# EAGLE design simple_led_button (EAGLE 8.7.0)
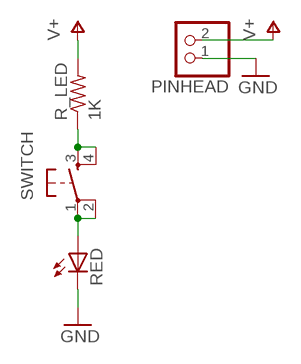
[diagram p0: schematic, sheet 1]

## Parts
PINHEAD  PINHD-1X2  [1X02]
R_LED  1K  RES-US1206FAB  [R1206FAB]
RED  LEDFAB1206  [LED1206FAB]
SWITCH  6MM_SWITCH6MM_SWITCH  [6MM_SWITCH]

## Nets
GND: PINHEAD.1 RED.2(C)
N$1: R_LED.1 SWITCH.3(S) SWITCH.4(S1)
N$2: RED.1(A) SWITCH.1(P) SWITCH.2(P1)
V+: PINHEAD.2 R_LED.2

## Library data of the parts
PINHEAD = pinhead:PINHD-1X2: PIN HEADER
R_LED = fab:RES-US: Resistor (US Symbol) Variants with postfix FAB are widened to allow the routing of internal traces
RED = fab:LED: LED
SWITCH = fab:6MM_SWITCH: OMRON SWITCH

## Board
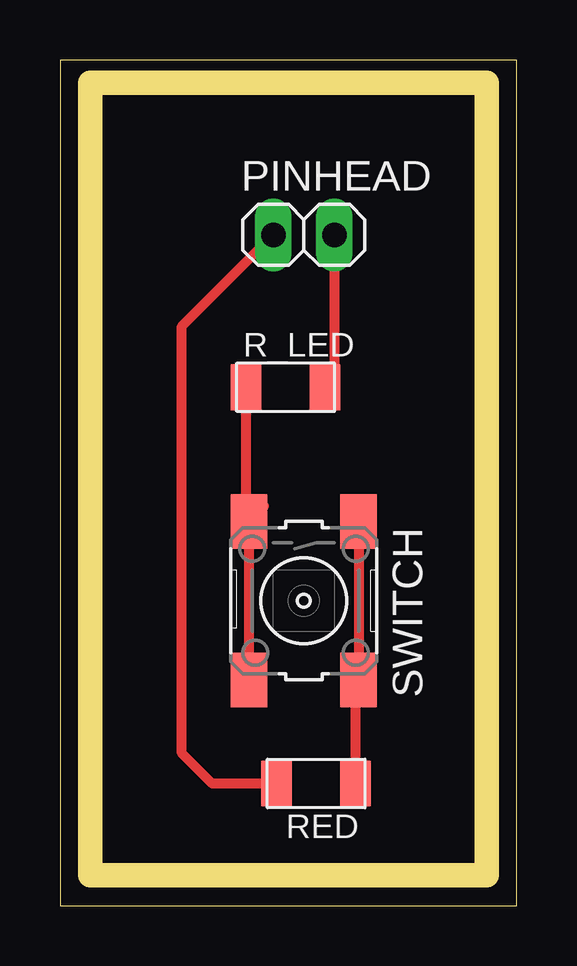
[diagram p1: board, top side]

Size 19.03 x 35.23 mm. Coordinates in mm from the lower left corner, seen from the top.
Outline: 0,0 19.03,0 19.03,35.23 0,35.23 0,0
Copper layers (1*16): Top 0.035mm / dielectric 1.5mm / Bottom 0.035mm
Design rules "default *": minimum track width 16mil, minimum drill 0.35mm, track to track 16mil, track to pad 16mil, pad to pad 16mil, via to via 16mil, smd to smd 16mil, copper to edge 40mil, drill to drill 6mil, minimum pad ring 10mil, minimum via ring 8mil, stop-mask expansion 4mil, vias tented up to drill 0mil, thermal gap 20mil
Milling: 4 lines

### Footprints (pad centres in the part's own frame; a part is rotated, then mirrored left to right if it is on the bottom)
1X02 = drill 1.016 long: 1 -1.27,0; 2 1.27,0
R1206FAB = smd 1.27 x 1.905: 1 -1.651,0; 2 1.651,0
LED1206FAB = smd 1.27 x 1.905: 1 -1.651,0; 2 1.651,0
6MM_SWITCH = smd 2.286 x 1.524: 1 -3.302,2.286; 2 3.302,2.286; 3 -3.302,-2.286; 4 3.302,-2.286

### Placement (x,y rotation side)
PINHEAD  10.16,27.94 0 top
R_LED  9.4,21.59 0 top
RED  10.67,5.08 180 top
SWITCH  10.16,12.7 270 top

### Tracks (layer width: path | path; a pad name or v marks a point on that pad's centre or on a via)
GND
  Top 0.406: RED.2 6.35,5.08 5.08,6.35 5.08,24.13 PINHEAD.1
N$1
  Top 0.406: 8.51,16.64 SWITCH.3 | SWITCH.3 SWITCH.4 | R_LED.1 7.75,16.13 SWITCH.3
N$2
  Top 0.406: SWITCH.1 SWITCH.2 12.32,9.27 RED.1
V+
  Top 0.406: PINHEAD.2 11.43,21.97 R_LED.2